# EAGLE schematic Rev B (EAGLE 6.4)
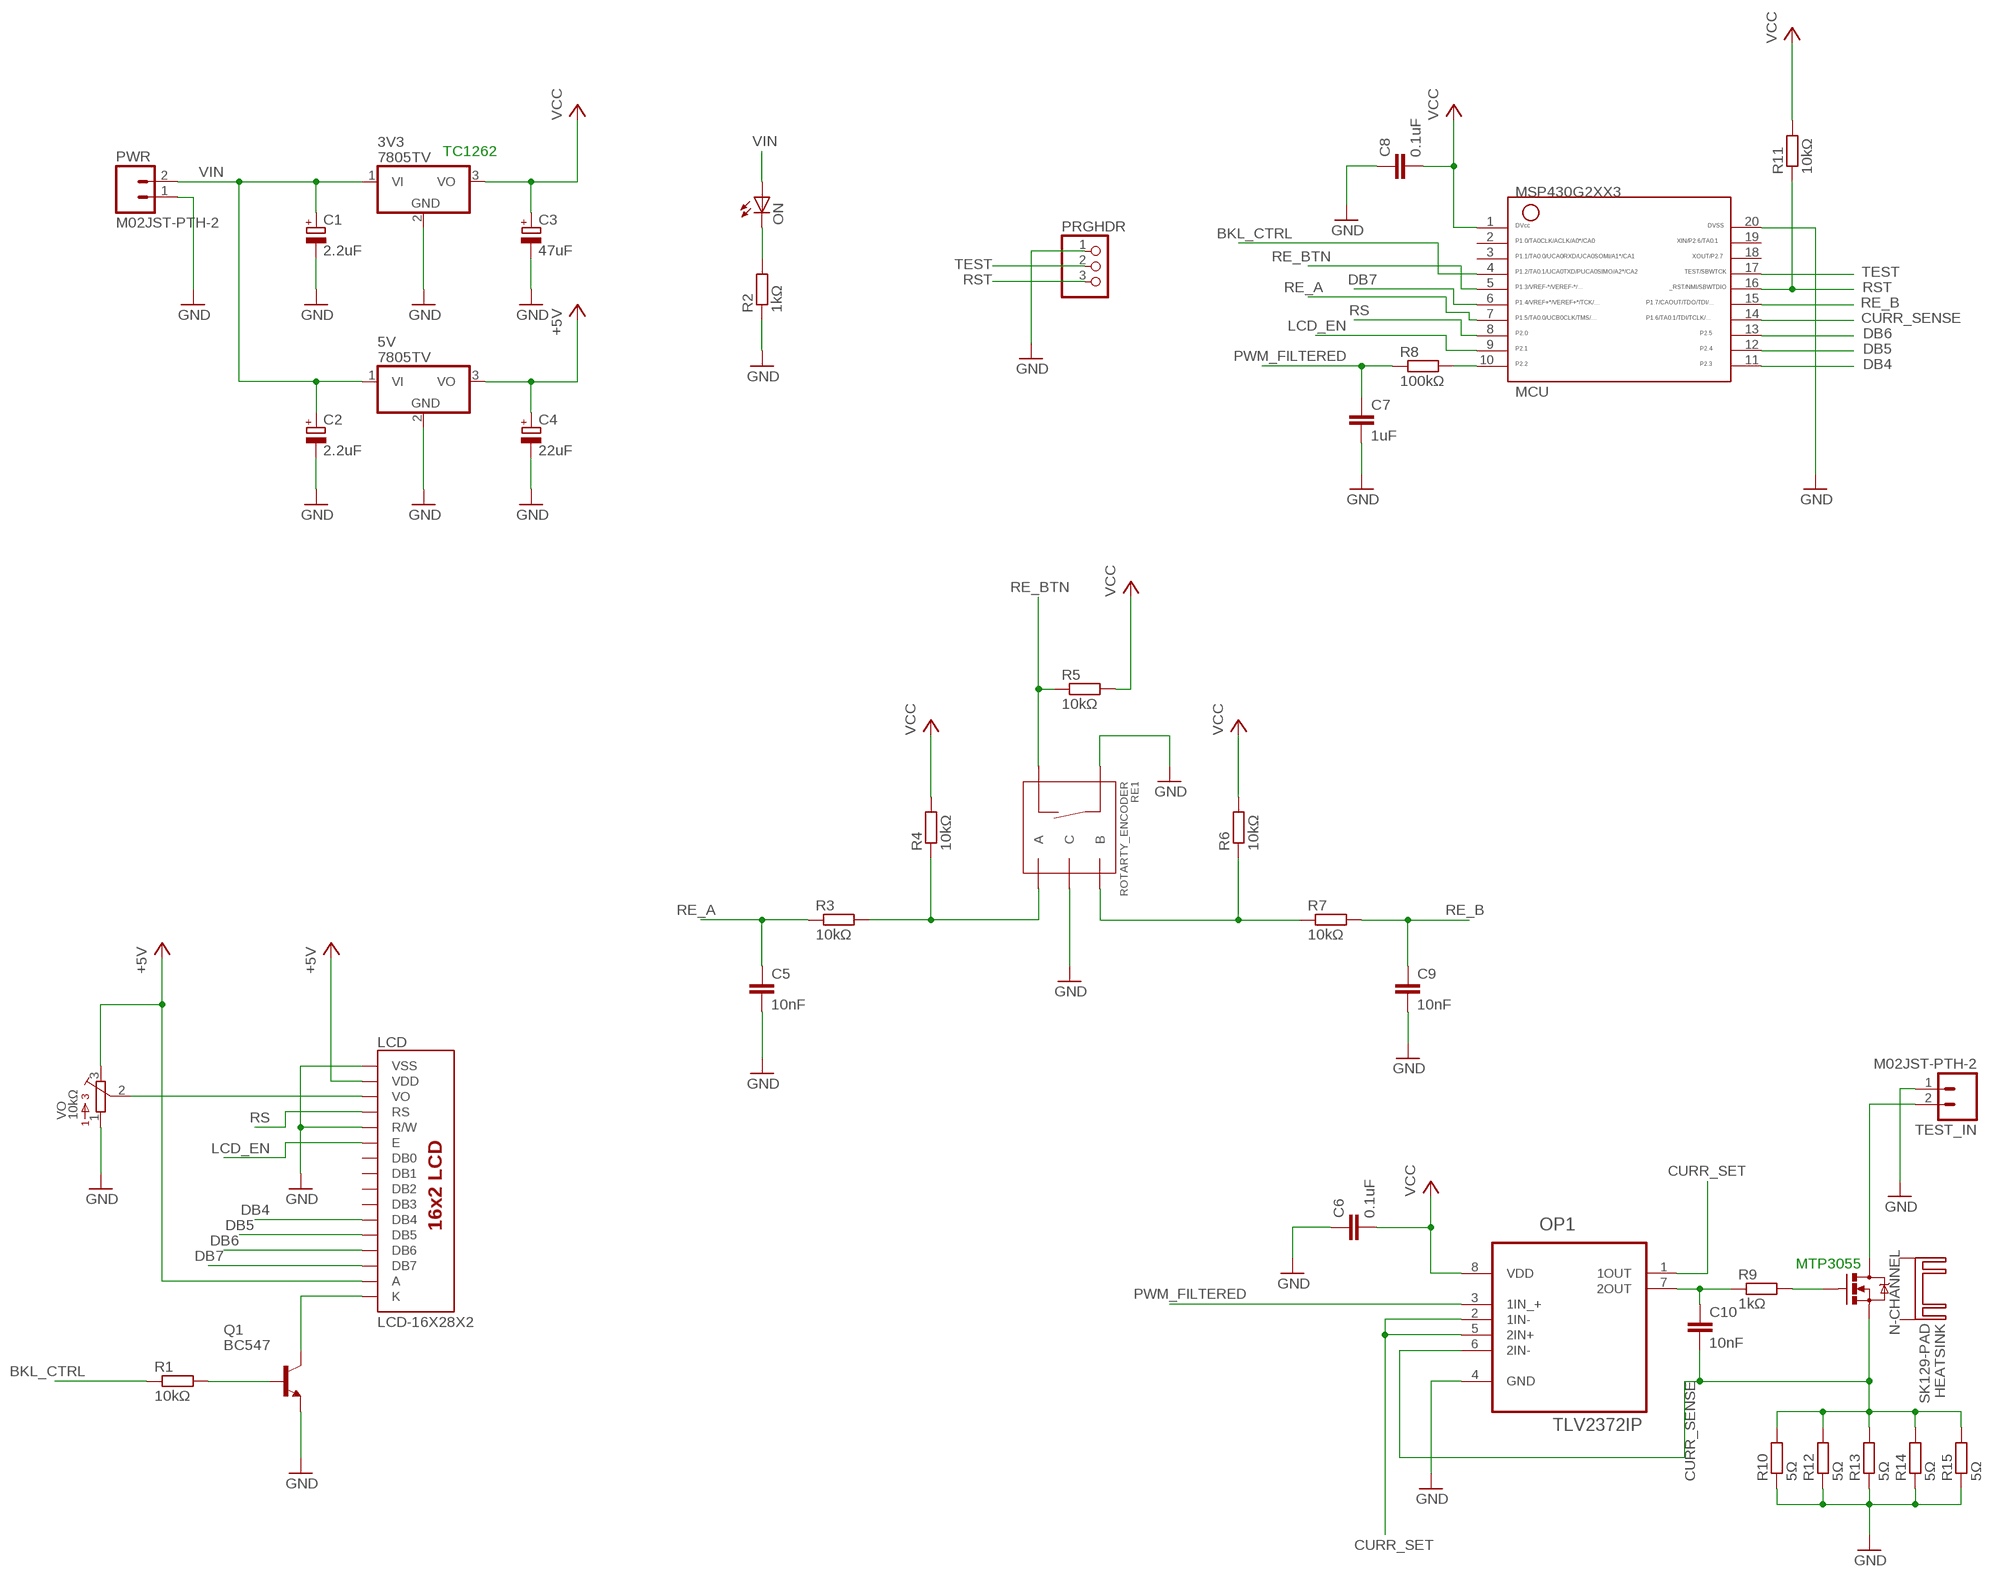
[diagram p0: schematic, sheet 1]

## Parts
3V3  7805TV  [TO220V]
5V  7805TV  [TO220V]
C1  2.2uF  CPOL-EUE2.5-6  [E2,5-6]
C2  2.2uF  CPOL-EUE2.5-6  [E2,5-6]
C3  47uF  CPOL-EUE2.5-6  [E2,5-6]
C4  22uF  CPOL-EUE2.5-6  [E2,5-6]
C5  10nF  C-EU050-025X075  [C050-025X075]
C6  0.1uF  C-EU050-025X075  [C050-025X075]
C7  1uF  C-EU025-025X050  [C025-025X050]
C8  0.1uF  C-EU050-025X075  [C050-025X075]
C9  10nF  C-EU050-025X075  [C050-025X075]
C10  10nF  C-EU050-025X075  [C050-025X075]
HEATSINK  SK129-PAD  [SK129]
LCD  LCD-16X28X2  [LCD-8X2]
MCU  G2XX3---N20  [N20]
N-CHANNEL  MOSFET-NCHANNELFQP30N06L  [TO220V]
ON  LEDSQR2X5  [LED2X5]
OP1  TLV2372IP  [DIP254P762X508-8]
PRGHDR  PINHD-1X3  [1X03]
PWR  M02JST-PTH-2  [JST-2-PTH]
Q1  BC547  [TO92]
R1  10kΩ  R-EU_0207/10  [0207/10]
R2  1kΩ  R-EU_0207/10  [0207/10]
R3  10kΩ  R-EU_0207/10  [0207/10]
R4  10kΩ  R-EU_0207/10  [0207/10]
R5  10kΩ  R-EU_0207/10  [0207/10]
R6  10kΩ  R-EU_0207/10  [0207/10]
R7  10kΩ  R-EU_0207/10  [0207/10]
R8  100kΩ  R-EU_0207/10  [0207/10]
R9  1kΩ  R-EU_0207/10  [0207/10]
R10  5Ω  R-EU_0613/15  [P0613/15]
R11  10kΩ  R-EU_0207/10  [0207/10]
R12  5Ω  R-EU_0613/15  [P0613/15]
R13  5Ω  R-EU_0613/15  [P0613/15]
R14  5Ω  R-EU_0613/15  [P0613/15]
R15  5Ω  R-EU_0613/15  [P0613/15]
RE1  ROTARTY_ENCODER  [ROTARY_ENC_PLAIN]
TEST_IN  M02JST-PTH-2  [JST-2-PTH]
VO  10kΩ  3362H  [3362H]

## Nets
+5V: 5V.3(VO) C4.+ LCD.2(VDD) LCD.15(A) VO.3
BKL_CTRL: MCU.4 R1.1
CURR_SENSE: C10.2 MCU.14 N-CHANNEL.3(S) OP1.6(2IN-) R10.2 R12.2 R13.2 R14.2 R15.2
CURR_SET: OP1.1(1OUT) OP1.2(1IN-) OP1.5(2IN+)
DB4: LCD.11(DB4) MCU.11
DB5: LCD.12(DB5) MCU.12
DB6: LCD.13(DB6) MCU.13
DB7: LCD.14(DB7) MCU.6
GND: 3V3.2(GND) 5V.2(GND) C1.- C2.- C3.- C4.- C5.2 C6.1 C7.2 C8.1 C9.2 LCD.1(VSS) LCD.5(R/W) MCU.20 OP1.4(GND) PRGHDR.1 PWR.1 Q1.1(E) R2.1 R10.1 R12.1 R13.1 R14.1 R15.1 RE1.C RE1.SW+ TEST_IN.1 VO.1
LCD_EN: LCD.6(E) MCU.9
N$3: N-CHANNEL.1(G) R9.2
N$4: C10.1 OP1.7(2OUT) R9.1
N$6: ON.K(C) R2.2
N$8: MCU.10 R8.2
N$9: LCD.16(K) Q1.3(C)
N$10: LCD.3(VO) VO.2
N$16: Q1.2(B) R1.2
PWM_FILTERED: C7.1 OP1.3(1IN_+) R8.1
RE_A: C5.1 MCU.7 R3.1
RE_A_: R3.2 R4.1 RE1.A
RE_B: C9.1 MCU.15 R7.2
RE_B_: R6.1 R7.1 RE1.B
RE_BTN: MCU.5 R5.1 RE1.SW-
RS: LCD.4(RS) MCU.8
RST: MCU.16 PRGHDR.3 R11.1
TEST: MCU.17 PRGHDR.2
TVIN: N-CHANNEL.2(D) TEST_IN.2
VCC: 3V3.3(VO) C3.+ C6.2 C8.2 MCU.1 OP1.8(VDD) R4.2 R5.2 R6.2 R11.2
VIN: 3V3.1(VI) 5V.1(VI) C1.+ C2.+ ON.A PWR.2
Unconnected: HEATSINK.A2,5(K) HEATSINK.B2,5(K) LCD.7(DB0) LCD.8(DB1) LCD.9(DB2) LCD.10(DB3) MCU.2 MCU.3 MCU.18 MCU.19

## Notes on the sheet
- TC1262
- MTP3055

## Library data of the parts
3V3 5V = linear:78*: Positive VOLTAGE REGULATOR Source: http://cache.national.com/ds/LM/LM78L05.pdf http://www.fairchildsemi.com/ds/LM/LM7805.pdf
C1-C4 = rcl:CPOL-EU: POLARIZED CAPACITOR, European symbol
C5-C10 = rcl:C-EU: CAPACITOR, European symbol
HEATSINK = heatsink:SK129-PAD: HEATSINK manufacturer Fischer/distributor Buerklin
LCD = SparkFun-Displays:LCD-16X2: Standard text-only 16x2 parallel input LCD
MCU = TI_MSP430_v16:G2XX3---N20: MSP430G2XX1 PDIP (N) 20 Pin Package
N-CHANNEL = SparkFun-DiscreteSemi:MOSFET-NCHANNEL: Common NMOSFET Parts MFG P/N Store ID Prod ID FDD8780 TRANS-09984 SI7820DN TRANS-11055 FDS6630A IC-08089 2N7002PW TRANS-11151 FQP30N06L COM-10213 TRANS-10060 BSS123LT1G TRANS-08345 BSS138 TRANS-00830 BS170 2N7000; PROD_ID: TRANS-10060
ON = led:LED: LED OSRAM: - CHIPLED LG R971, LG N971, LY N971, LG Q971, LY Q971, LO R971, LY R971 LH N974, LH R974 LS Q976, LO Q976, LY Q976 LO Q996 - Hyper CHIPLED LW Q18S LB Q993, LB Q99A, LB R99A - SideLED LS A670, LO A670, LY A670, LG A670, LP A670 LB A673, LV A673, LT A673, LW A673 LH A674 LY A675 LS A676, LA A676, LO A676, LY A676, LW A676 LS A679, LY A679, LG A679 - Hyper Micro SIDELED® LS Y876, LA Y876, LO Y876, LY Y876 LT Y87S - SmartLED LW L88C, LW L88S LB L89C, LB L89S, LG L890 LS L89K, LO L89K, LY L89K LS L896, LA L896, LO L896, LY L896 - TOPLED LS T670, LO T670, LY T670, LG T670, LP T670 LSG T670, LSP T670, LSY T670, LOP T670, LYG T670 LG T671, LOG T671, LSG T671 LB T673, LV T673, LT T673, LW T673 LH T674 LS T676, LA T676, LO T676, LY T676, LB T676, LH T676, LSB T676, LW T676 LB T67C, LV T67C, LT T67C, LS T67K, LO T67K, LY T67K, LW E67C LS E67B, LA E67B, LO E67B, LY E67B, LB E67C, LV E67C, LT E67C LW T67C LS T679, LY T679, LG T679 LS T770, LO T770, LY T770, LG T770, LP T770 LB T773, LV T773, LT T773, LW T773 LH T774 LS E675, LA E675, LY E675, LS T675 LS T776, LA T776, LO T776, LY T776, LB T776 LHGB T686 LT T68C, LB T68C - Hyper Mini TOPLED® LB M676 - Mini TOPLED Santana® LG M470 LS M47K, LO M47K, LY M47K Source: http://www.osram.convergy.de LUXEON: - LUMILED® LXK2-PW12-R00, LXK2-PW12-S00, LXK2-PW14-U00, LXK2-PW14-V00 LXK2-PM12-R00, LXK2-PM12-S00, LXK2-PM14-U00 LXK2-PE12-Q00, LXK2-PE12-R00, LXK2-PE12-S00, LXK2-PE14-T00, LXK2-PE14-U00 LXK2-PB12-K00, LXK2-PB12-L00, LXK2-PB12-M00, LXK2-PB14-N00, LXK2-PB14-P00, LXK2-PB14-Q00 LXK2-PR12-L00, LXK2-PR12-M00, LXK2-PR14-Q00, LXK2-PR14-R00 LXK2-PD12-Q00, LXK2-PD12-R00, LXK2-PD12-S00 LXK2-PH12-R00, LXK2-PH12-S00 LXK2-PL12-P00, LXK2-PL12-Q00, LXK2-PL12-R00 Source: www.luxeon.com KINGBRIGHT: KA-3528ASYC Source: www.kingbright.com
OP1 = Texas Instruments_By_element14_Batch_1:TLV2372IP: OPERATIONAL AMPLIFIER; MPN: TLV2372IP; OC_FARNELL: 8455031; OC_NEWARK: 76C7976; PACKAGE: PDIP; SUPPLIER: Texas Instruments
PRGHDR = pinhead:PINHD-1X3: PIN HEADER
PWR TEST_IN = SparkFun-Connectors:M02: Standard 2-pin 0.1" header. Use with - straight break away headers ( PRT-00116) - right angle break away headers (PRT-00553) - swiss pins (PRT-00743) - machine pins (PRT-00117) - female headers (PRT-00115) Molex polarized connector foot print use with: PRT-08233 with associated crimp pins and housings. 2.54_SCREWTERM for use with PRT-10571. 3.5mm Screw Terminal footprints for PRT-08084 5mm Screw Terminal footprints for use with PRT-08433
Q1 = transistor-npn:BC547*: NPN Transistor
R1-R9 R11 = resistor:R-EU_: RESISTOR, European symbol
R10 R12-R15 = rcl:R-EU_: RESISTOR, European symbol
RE1 = SparkFun-Electromechanical:ROTARTY_ENCODER: Simple no LED rotary encoder Example: COM-09117
VO = bourns:3362: 3362 Series 1/4" Square Trimmer